# EAGLE board ABK-ECS - Rev A2 (EAGLE 7.7.0)
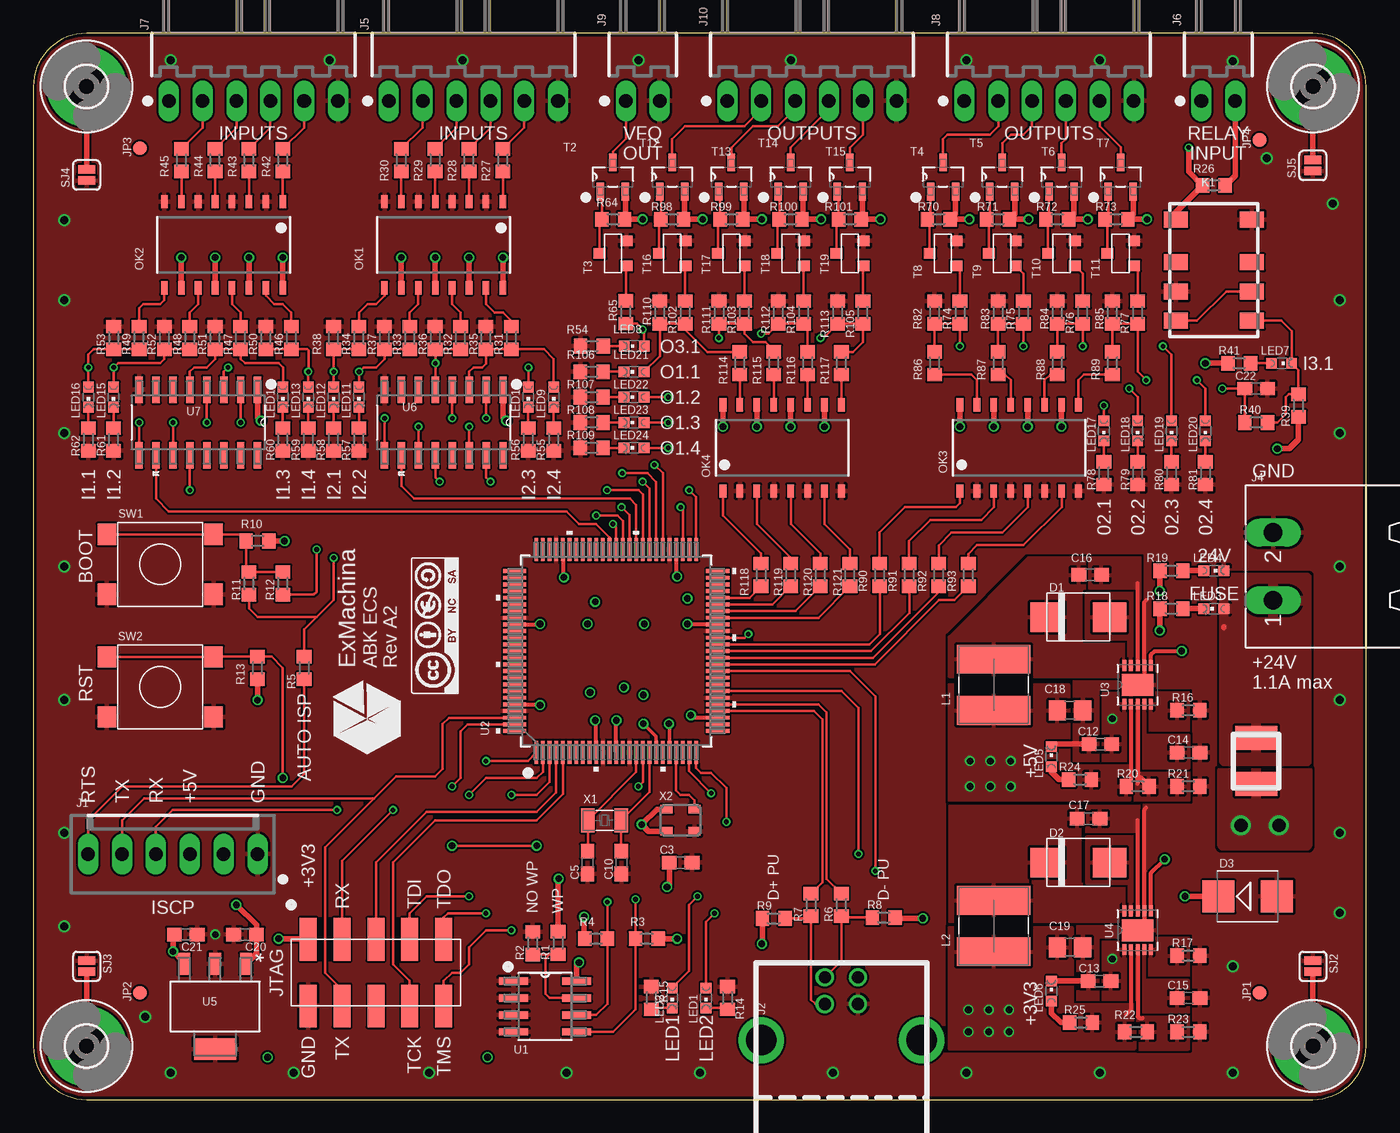
[diagram p5: board, top side]
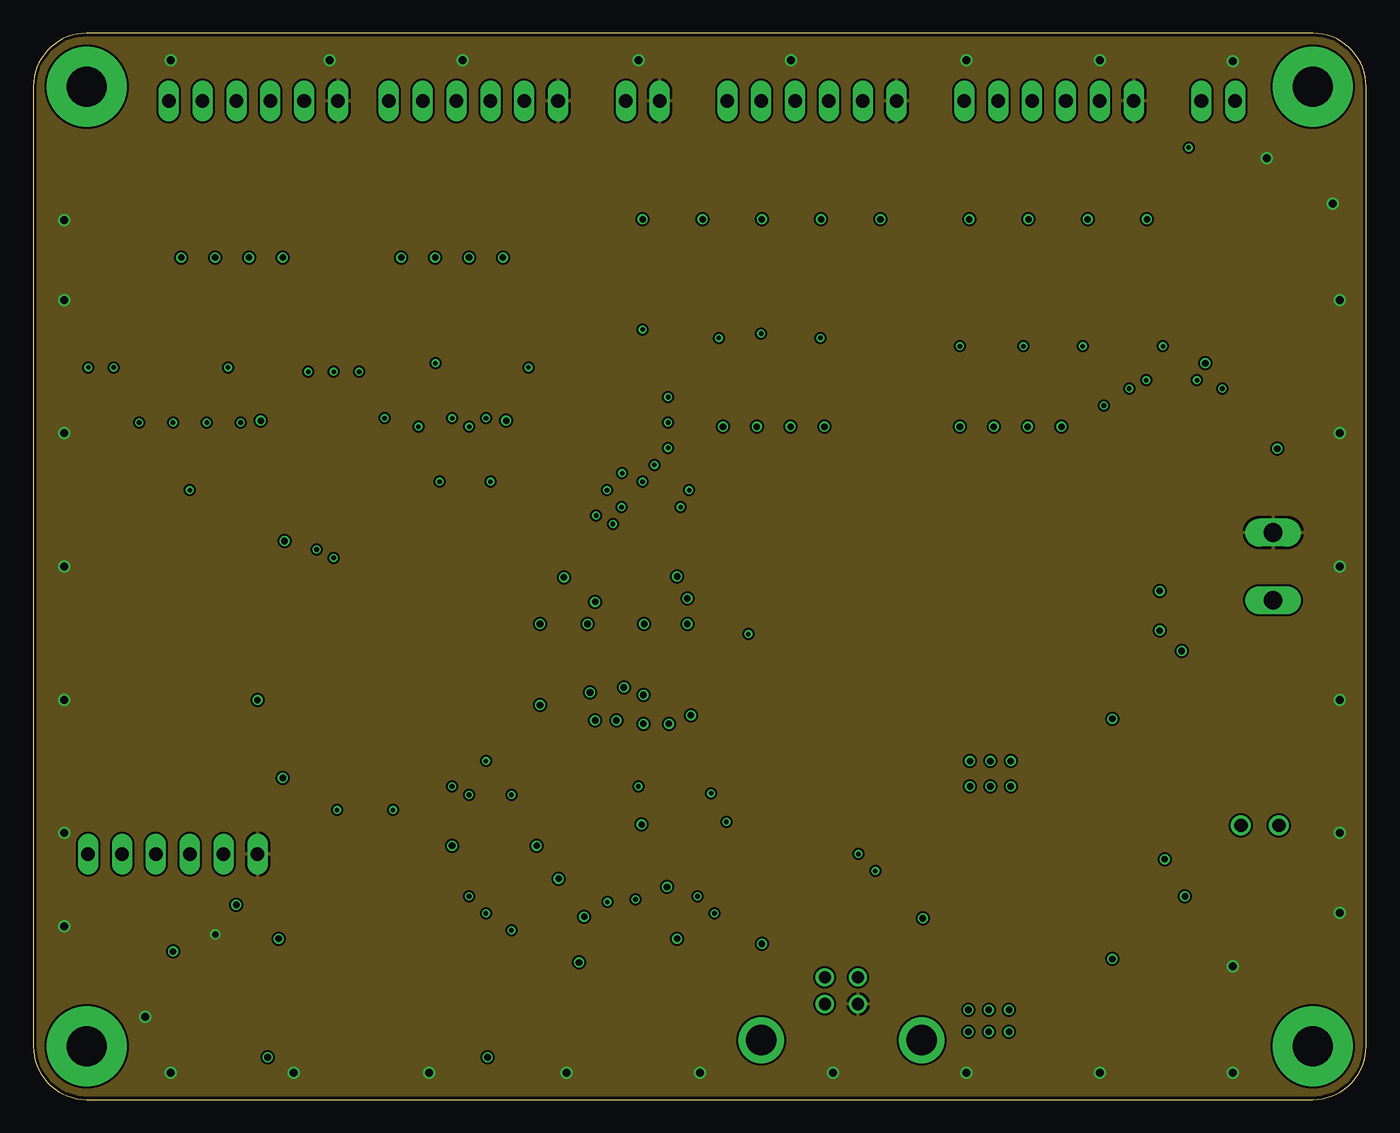
[diagram p6: board, inner layer Route2]
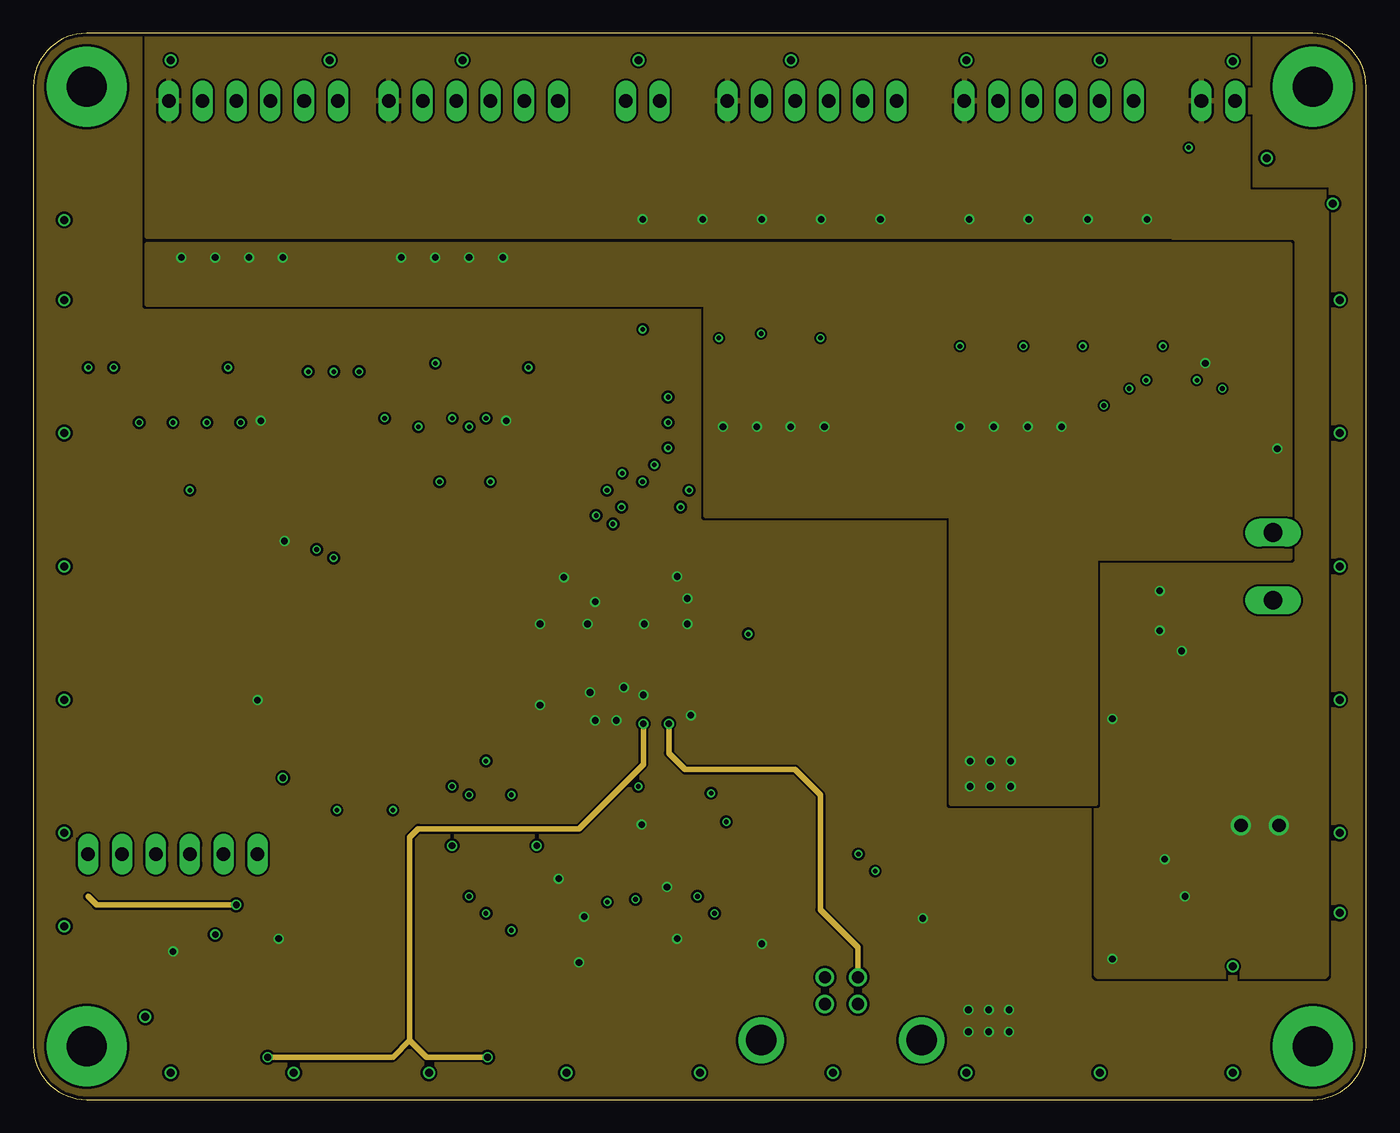
[diagram p7: board, inner layer Route15]
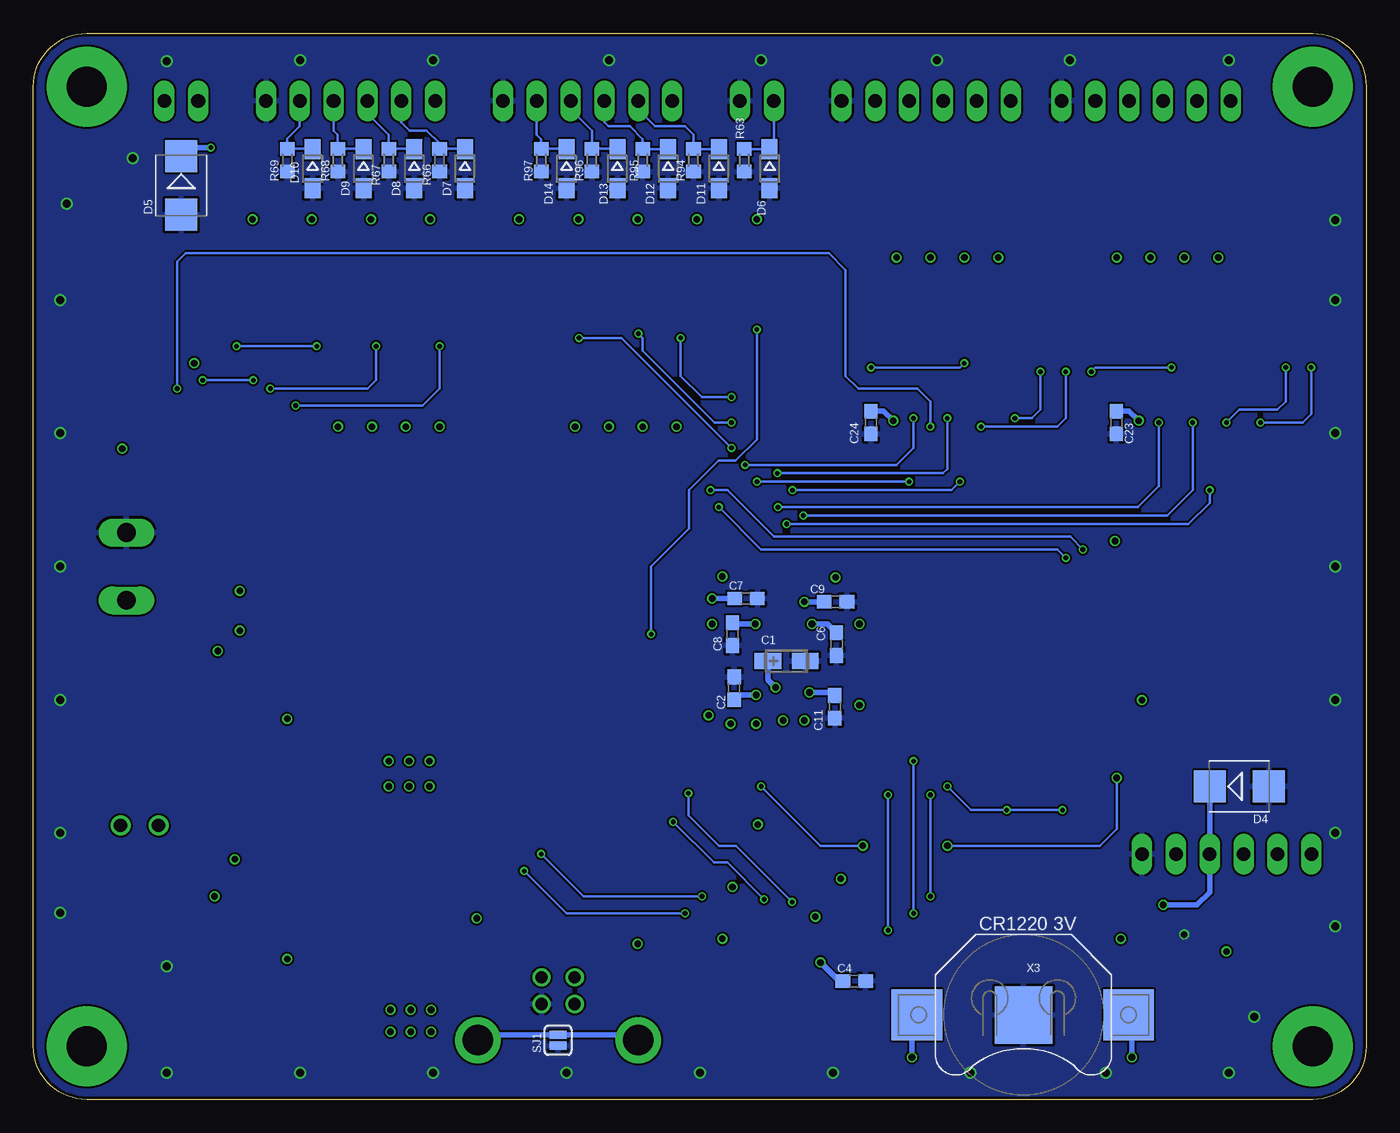
[diagram p8: board, bottom side, seen from below]

Size 100 x 80 mm. Coordinates in mm from the lower left corner, seen from the top.
Outline: 4,0 96,0 arc90 100,4 100,76 arc90 96,80 4,80 arc90 0,76 0,4 arc90 4,0
Copper layers (1+2*15+16): Top 0.018mm / dielectric 0.36mm / Route2 0.035mm / dielectric 0.71mm / Route15 0.035mm / dielectric 0.2mm / Bottom 0.018mm
Design rules "eC_4Layer_PClass6_BaseCopperO18-I35_eCDefault *": minimum track width 0.15mm, minimum drill 0.35mm, track to track 0.15mm, track to pad 0.15mm, pad to pad 0.15mm, via to via 0.15mm, smd to smd 0mil, copper to edge 0.25mm, drill to drill 0.35mm, minimum pad ring 0.175mm, minimum via ring 0.125mm, stop-mask expansion 0mil, vias tented up to drill 0.45mm, thermal gap 0.2mm
Net classes: 0 default: width 0.178 mm; 1 signal: width 0.178 mm, drill 0.35 mm; 2 supply: width 0.008 mm, drill 0.5 mm

## Footprints (pad centres in the part's own frame; a part is rotated, then mirrored left to right if it is on the bottom)
CT3216 = smd 2 x 1.2: + -1.4,0; - 1.4,0
C0603 = smd 1.1 x 1: 1 -0.85,0; 2 0.85,0
C0805 = smd 1.3 x 1.5: 1 -0.95,0; 2 0.95,0
DO-214AA = smd 2.5 x 2.2: A 2.35,0; C -2.35,0
SMB = smd 2.4 x 2.4: A 2.2,0; C -2.2,0
SOD323-W = smd 1.5 x 1.2: A 1.45,0; C -1.45,0
LITTLEFUSE_SMD = smd 1.78 x 3.15: 1 -1.725,0; 2 1.725,0
6410-06 = drill 1.016 long: 1 6.35,0; 2 3.81,0; 3 1.27,0; 4 -1.27,0; 5 -3.81,0; 6 -6.35,0
USB-B-S-RA = drill 0.914: 1 1.245,4.724; 2 -1.245,4.724; 3 -1.245,2.718; 4 1.245,2.718 | drill 2.286: SHL 6.02,0; SHL1 -6.02,0
2.54/2X5 = smd 1.27 x 3.2: 1 -5.08,2.5; 2 -5.08,-2.5; 3 -2.54,2.5; 4 -2.54,-2.5; 5 0,2.5; 6 0,-2.5; 7 2.54,2.5; 8 2.54,-2.5; 9 5.08,2.5; 10 5.08,-2.5
MSTBA2 = drill 1.397 long: 1 -2.54,5.08; 2 2.54,5.08
7395-06 = drill 1.016 long: 1 6.35,0; 2 3.81,0; 3 1.27,0; 4 -1.27,0; 5 -3.81,0; 6 -6.35,0
7395-02 = drill 1.016 long: 1 1.27,0; 2 -1.27,0
FIDUCIAL-1X2 = smd 1 x 1: 1 0,0
G6K-2G-Y = smd 1.2 x 1.8: 1 -3.8,-2.85; 2 -0.6,-2.85; 3 1.6,-2.85; 4 3.8,-2.85; 5 3.8,2.85; 6 1.6,2.85; 7 -0.6,2.85; 8 -3.8,2.85
WE-PD2_5848/5820 = smd 2.15 x 5.5: 1 -1.925,0; 2 1.925,0
CHIPLED_0603 = smd 0.8 x 0.8: A 0,-0.75; C 0,0.75
P3,0 = drill 3 pad 6: 1 0,0
MINI-FLAT-16 = smd 1 x 0.5: 1 -3.24,4.445; 2 -3.24,3.175; 3 -3.24,1.905; 4 -3.24,0.635; 5 -3.24,-0.635; 6 -3.24,-1.905; 7 -3.24,-3.175; 8 -3.24,-4.445; 9 3.24,-4.445; 10 3.24,-3.175; 11 3.24,-1.905; 12 3.24,-0.635; 13 3.24,0.635; 14 3.24,1.905; 15 3.24,3.175; 16 3.24,4.445
R0603 = smd 1 x 1.1: 1 -0.85,0; 2 0.85,0
SJ_2S = smd 0.635 x 1.27: 1 -0.412,0; 2 0.412,0
B3FS = smd 1.4 x 1.6: 1 4,-2.25; 2 -4,-2.25; 3 4,2.25; 4 -4,2.25
SOT95P240X112-3N = smd 1.321 x 0.559: 1 -1.092,0.94; 2 -1.092,-0.94; 3 1.092,0
SOT−23 = smd 0.787 x 0.889: 1 0.94,1.003; 2 -0.94,1.003; 3 0,-1.003
SOIC127P600X175-8N = smd 2.184 x 0.559: 1 -2.362,1.905; 2 -2.362,0.635; 3 -2.362,-0.635; 4 -2.362,-1.905; 5 2.362,-1.905; 6 2.362,-0.635; 7 2.362,0.635; 8 2.362,1.905
SOT407-1 = smd 1.727 x 0.279: 1 -7.62,6; 2 -7.62,5.5; 3 -7.62,5; 4 -7.62,4.5; 5 -7.62,4; 6 -7.62,3.5; 7 -7.62,3; 8 -7.62,2.5; 9 -7.62,2; 10 -7.62,1.5; 11 -7.62,1; 12 -7.62,0.5; 13 -7.62,0; 14 -7.62,-0.5; 15 -7.62,-1; 16 -7.62,-1.5; 17 -7.62,-2; 18 -7.62,-2.5; 19 -7.62,-3; 20 -7.62,-3.5; 21 -7.62,-4; 22 -7.62,-4.5; 23 -7.62,-5; 24 -7.62,-5.5; 25 -7.62,-6; 51 7.62,-6; 52 7.62,-5.5; 53 7.62,-5; 54 7.62,-4.5; 55 7.62,-4; 56 7.62,-3.5; 57 7.62,-3; 58 7.62,-2.5; 59 7.62,-2; 60 7.62,-1.5; 61 7.62,-1; 62 7.62,-0.5; 63 7.62,0; 64 7.62,0.5; 65 7.62,1; 66 7.62,1.5; 67 7.62,2; 68 7.62,2.5; 69 7.62,3; 70 7.62,3.5; 71 7.62,4; 72 7.62,4.5; 73 7.62,5; 74 7.62,5.5; 75 7.62,6 | smd 0.279 x 1.727: 26 -6,-7.62; 27 -5.5,-7.62; 28 -5,-7.62; 29 -4.5,-7.62; 30 -4,-7.62; 31 -3.5,-7.62; 32 -3,-7.62; 33 -2.5,-7.62; 34 -2,-7.62; 35 -1.5,-7.62; 36 -1,-7.62; 37 -0.5,-7.62; 38 0,-7.62; 39 0.5,-7.62; 40 1,-7.62; 41 1.5,-7.62; 42 2,-7.62; 43 2.5,-7.62; 44 3,-7.62; 45 3.5,-7.62; 46 4,-7.62; 47 4.5,-7.62; 48 5,-7.62; 49 5.5,-7.62; 50 6,-7.62; 76 6,7.62; 77 5.5,7.62; 78 5,7.62; 79 4.5,7.62; 80 4,7.62; 81 3.5,7.62; 82 3,7.62; 83 2.5,7.62; 84 2,7.62; 85 1.5,7.62; 86 1,7.62; 87 0.5,7.62; 88 0,7.62; 89 -0.5,7.62; 90 -1,7.62; 91 -1.5,7.62; 92 -2,7.62; 93 -2.5,7.62; 94 -3,7.62; 95 -3.5,7.62; 96 -4,7.62; 97 -4.5,7.62; 98 -5,7.62; 99 -5.5,7.62; 100 -6,7.62
DFN300X300X80-11N = smd 0.813 x 0.305: 1 -1.448,0.991; 2 -1.448,0.508; 3 -1.448,0; 4 -1.448,-0.508; 5 -1.448,-0.991; 6 1.448,-0.991; 7 1.448,-0.508; 8 1.448,0; 9 1.448,0.508; 10 1.448,0.991 | smd 1.651 x 2.388: 11 0,0
SOT230P700X180-4N = smd 1.626 x 0.889: 1 -3.2,2.311; 2 -3.2,0; 3 -3.2,-2.311 | smd 1.626 x 3.175: 4 3.2,0
SOIC127P600X175-16N = smd 1.981 x 0.559: 1 -2.464,4.445; 2 -2.464,3.175; 3 -2.464,1.905; 4 -2.464,0.635; 5 -2.464,-0.635; 6 -2.464,-1.905; 7 -2.464,-3.175; 8 -2.464,-4.445; 9 2.464,-4.445; 10 2.464,-3.175; 11 2.464,-1.905; 12 2.464,-0.635; 13 2.464,0.635; 14 2.464,1.905; 15 2.464,3.175; 16 2.464,4.445
FC-135 = smd 1 x 1.8: 1 -1.25,0; 2 1.25,0
ASE = smd 0.9 x 0.65: 1 -1.05,-0.825; 2 1.05,-0.825; 3 1.05,0.825; 4 -1.05,0.825
3000 = smd 3.81 x 3.81: +1 -7.874,0; +2 8.001,0 | smd 4.318 x 4.318: - 0,0

## Placement (x,y rotation side)
C1  10uF  [CT3216]  43.48,32.89 0 bottom
C2  0.1uF  [C0603]  47.42,30.86 90 bottom
C3  0.1uF  [C0603]  48.56,17.78 0 top
C4  0.1uF  [C0603]  38.41,8.89 0 bottom
C5  18pF  [C0603]  41.58,17.78 270 top
C6  0.1uF  [C0603]  39.74,34.16 270 bottom
C7  0.1uF  [C0603]  46.53,37.59 0 bottom
C8  0.1uF  [C0603]  47.55,34.92 270 bottom
C9  0.1uF  [C0603]  39.8,37.34 0 bottom
C10  18pF  [C0603]  44.12,17.78 270 top
C11  0.1uF  [C0603]  39.87,29.46 270 bottom
C12  2.2uF  [C0603]  80.06,26.67 180 top
C13  2.2uF  [C0603]  80,8.89 180 top
C14  1000pF  [C0603]  86.67,26.04 0 top
C15  1000pF  [C0603]  86.67,7.62 0 top
C16  2.2uF  [C0603]  79.3,39.37 180 top
C17  2.2uF  [C0603]  79.17,21.08 180 top
C18  22uF  [C0805]  77.78,29.21 0 top
C19  22uF  [C0805]  77.78,11.43 0 top
C20  1u  [C0603]  15.89,12.38 180 top
C21  1u  [C0603]  11.44,12.38 0 top
C22  0.1uF  [C0603]  91.75,53.34 0 top
C23  0.1uF  [C0603]  18.75,50.8 270 bottom
C24  0.1uF  [C0603]  37.16,50.8 270 bottom
CC1  CC-BY-NC-SA  [CC-BY-NC-SA]  30.15,35.56 90 top
D1  MBRS140  [DO-214AA]  78.41,36.2 0 top
D2  MBRS140  [DO-214AA]  78.41,17.78 0 top
D3  STPS3L40UF  [SMB]  91.11,15.24 0 top
D4  STPS3L40UF  [SMB]  9.53,23.5 0 bottom
D5  STPS3L40UF  [SMB]  88.9,68.59 270 bottom
D6  1N4148WS  [SOD323-W]  44.76,69.85 270 bottom
D7  1N4148WS  [SOD323-W]  67.61,69.85 270 bottom
D8  1N4148WS  [SOD323-W]  71.42,69.85 270 bottom
D9  1N4148WS  [SOD323-W]  75.23,69.85 270 bottom
D10  1N4148WS  [SOD323-W]  79.05,69.85 270 bottom
D11  1N4148WS  [SOD323-W]  48.56,69.85 270 bottom
D12  1N4148WS  [SOD323-W]  52.38,69.85 270 bottom
D13  1N4148WS  [SOD323-W]  56.19,69.85 270 bottom
D14  1N4148WS  [SOD323-W]  59.99,69.85 270 bottom
F1  1812L110/24DR  [LITTLEFUSE_SMD]  91.75,25.4 270 top
J1  22-27-2061-06  [6410-06]  10.46,18.41 0 top
J2  USB-B-S-RA  [USB-B-S-RA]  60.63,4.45 0 top
J3  1241050-5  [2.54/2X5]  25.7,9.53 0 top
J4  MSTBA2  [MSTBA2]  98.09,40 90 top
J5  22-05-7068-06  [7395-06]  33.02,74.93 180 top
J6  22-05-7028-02  [7395-02]  88.9,74.93 180 top
J7  22-05-7068-06  [7395-06]  16.51,74.93 180 top
J8  22-05-7068-06  [7395-06]  76.2,74.93 180 top
J9  22-05-7028-02  [7395-02]  45.72,74.93 180 top
J10  22-05-7068-06  [7395-06]  58.42,74.93 180 top
JP1  FIDUCIAL1X2  [FIDUCIAL-1X2]  92,8 90 top
JP2  FIDUCIAL1X2  [FIDUCIAL-1X2]  8,8 90 top
JP3  FIDUCIAL1X2  [FIDUCIAL-1X2]  8,71.36 90 top
JP4  FIDUCIAL1X2  [FIDUCIAL-1X2]  92,72 90 top
K1  G6K-2G-Y  [G6K-2G-Y]  88.57,62.23 270 top
L1  15uH  [WE-PD2_5848/5820]  72.06,31.11 270 top
L2  10uH  [WE-PD2_5848/5820]  72.06,13.02 270 top
LED1  Blue  [CHIPLED_0603]  50.47,7.62 180 top
LED2  Blue  [CHIPLED_0603]  47.93,7.62 180 top
LED3  Red  [CHIPLED_0603]  88.57,36.83 90 top
LED4  Blue  [CHIPLED_0603]  88.57,39.69 270 top
LED5  Blue  [CHIPLED_0603]  76.38,25.72 0 top
LED6  Blue  [CHIPLED_0603]  76.38,8.13 0 top
LED7  Red  [CHIPLED_0603]  93.65,55.24 270 top
LED8  Blue  [CHIPLED_0603]  45.09,56.53 90 top
LED9  Blue  [CHIPLED_0603]  39.04,52.7 180 top
LED10  Blue  [CHIPLED_0603]  37.13,52.7 180 top
LED11  Blue  [CHIPLED_0603]  24.43,52.7 180 top
LED12  Blue  [CHIPLED_0603]  22.53,52.7 180 top
LED13  Blue  [CHIPLED_0603]  20.62,52.7 180 top
LED14  Blue  [CHIPLED_0603]  18.72,52.7 180 top
LED15  Blue  [CHIPLED_0603]  6.02,52.7 180 top
LED16  Blue  [CHIPLED_0603]  4.13,52.7 180 top
LED17  Blue  [CHIPLED_0603]  80.31,50.16 180 top
LED18  Blue  [CHIPLED_0603]  82.86,50.16 180 top
LED19  Blue  [CHIPLED_0603]  85.39,50.16 180 top
LED20  Blue  [CHIPLED_0603]  87.94,50.16 180 top
LED21  Blue  [CHIPLED_0603]  45.07,54.61 90 top
LED22  Blue  [CHIPLED_0603]  45.07,52.7 90 top
LED23  Blue  [CHIPLED_0603]  45.07,50.8 90 top
LED24  Blue  [CHIPLED_0603]  45.07,48.9 90 top
MP1  MOUNT-PAD3,0  [P3,0]  96,4 90 top
MP2  MOUNT-PAD3,0  [P3,0]  4,4 90 top
MP3  MOUNT-PAD3,0  [P3,0]  4,76 90 top
MP4  MOUNT-PAD3,0  [P3,0]  96,76 90 top
OK1  TLP283-4  [MINI-FLAT-16]  30.79,64.14 270 top
OK2  TLP283-4  [MINI-FLAT-16]  14.28,64.14 270 top
OK3  TLP283-4  [MINI-FLAT-16]  73.97,48.9 90 top
OK4  TLP283-4  [MINI-FLAT-16]  56.19,48.9 90 top
R1  4K7, DNI  [R0603]  39.37,11.75 270 top
R2  4K7  [R0603]  37.47,11.73 90 top
R3  4K7  [R0603]  46.02,12.06 0 top
R4  4K7  [R0603]  42.22,12.06 180 top
R5  0R  [R0603]  20.32,32.38 270 top
R6  33  [R0603]  60.63,14.61 90 top
R7  33  [R0603]  58.34,14.61 90 top
R8  1K5, DNI  [R0603]  63.8,13.65 180 top
R9  1K5, DNI  [R0603]  55.55,13.59 0 top
R10  10K  [R0603]  16.82,41.91 0 top
R11  0R  [R0603]  16.18,38.73 90 top
R12  0R  [R0603]  18.72,38.73 90 top
R13  10K  [R0603]  16.82,32.38 270 top
R14  1K5  [R0603]  52.08,7.62 90 top
R15  1K5  [R0603]  46.37,7.62 90 top
R16  31K6  [R0603]  86.67,29.21 180 top
R17  31K6  [R0603]  86.67,10.79 180 top
R18  4K7  [R0603]  85.39,36.83 180 top
R19  4K7  [R0603]  85.39,39.69 180 top
R20  52K3  [R0603]  82.86,23.5 180 top
R21  10K  [R0603]  86.67,23.5 180 top
R22  31K6  [R0603]  82.73,5.08 180 top
R23  10K  [R0603]  86.67,5.08 180 top
R24  1K5  [R0603]  78.54,24 0 top
R25  1K5  [R0603]  78.6,5.78 0 top
R26  100  [R0603]  88.57,68.58 180 top
R27  1K  [R0603]  35.23,70.48 270 top
R28  1K  [R0603]  32.69,70.48 270 top
R29  1K  [R0603]  30.15,70.48 270 top
R30  1K  [R0603]  27.61,70.48 270 top
R31  1K  [R0603]  35.87,57.15 270 top
R32  1K  [R0603]  32.05,57.15 270 top
R33  1K  [R0603]  28.25,57.15 270 top
R34  1K  [R0603]  24.43,57.15 270 top
R35  4K7  [R0603]  33.96,57.15 90 top
R36  4K7  [R0603]  30.15,57.15 90 top
R37  4K7  [R0603]  26.34,57.15 90 top
R38  4K7  [R0603]  22.53,57.15 90 top
R39  4K7  [R0603]  94.92,52.07 90 top
R40  100  [R0603]  91.75,50.8 180 top
R41  1K5  [R0603]  90.47,55.24 180 top
R42  1K  [R0603]  18.72,70.48 270 top
R43  1K  [R0603]  16.18,70.48 270 top
R44  1K  [R0603]  13.64,70.48 270 top
R45  1K  [R0603]  11.11,70.48 270 top
R46  1K  [R0603]  19.36,57.15 270 top
R47  1K  [R0603]  15.54,57.15 270 top
R48  1K  [R0603]  11.73,57.15 270 top
R49  1K  [R0603]  7.94,57.15 270 top
R50  4K7  [R0603]  17.45,57.15 90 top
R51  4K7  [R0603]  13.64,57.15 90 top
R52  4K7  [R0603]  9.83,57.15 90 top
R53  4K7  [R0603]  6.03,57.15 90 top
R54  1K5  [R0603]  41.91,56.53 180 top
R55  1K5  [R0603]  39.04,49.53 270 top
R56  1K5  [R0603]  37.13,49.53 270 top
R57  1K5  [R0603]  24.43,49.53 270 top
R58  1K5  [R0603]  22.53,49.53 270 top
R59  1K5  [R0603]  20.62,49.53 270 top
R60  1K5  [R0603]  18.72,49.53 270 top
R61  1K5  [R0603]  6.02,49.53 270 top
R62  1K5  [R0603]  4.13,49.53 270 top
R63  10K  [R0603]  46.66,70.48 90 bottom
R64  10K  [R0603]  43.51,66.04 0 top
R65  100  [R0603]  44.45,59.07 270 top
R66  10K  [R0603]  69.52,70.48 90 bottom
R67  10K  [R0603]  73.33,70.48 90 bottom
R68  10K  [R0603]  77.14,70.48 90 bottom
R69  10K  [R0603]  80.95,70.48 90 bottom
R70  10K  [R0603]  67.93,66.04 0 top
R71  10K  [R0603]  72.38,66.04 0 top
R72  10K  [R0603]  76.82,66.04 0 top
R73  10K  [R0603]  81.27,66.04 0 top
R74  1K  [R0603]  69.52,59.05 90 top
R75  1K  [R0603]  74.28,59.05 90 top
R76  1K  [R0603]  78.73,59.05 90 top
R77  1K  [R0603]  82.86,59.05 90 top
R78  1K5  [R0603]  80.31,46.99 270 top
R79  1K5  [R0603]  82.86,46.99 270 top
R80  1K5  [R0603]  85.39,46.99 270 top
R81  1K5  [R0603]  87.94,46.99 270 top
R82  4K7  [R0603]  67.61,59.05 90 top
R83  4K7  [R0603]  72.38,59.05 90 top
R84  4K7  [R0603]  76.82,59.05 90 top
R85  4K7  [R0603]  80.95,59.05 90 top
R86  100  [R0603]  67.61,55.24 270 top
R87  100  [R0603]  72.38,55.24 270 top
R88  100  [R0603]  76.82,55.24 270 top
R89  100  [R0603]  80.95,55.24 270 top
R90  330  [R0603]  63.49,39.37 270 top
R91  330  [R0603]  65.71,39.37 270 top
R92  330  [R0603]  67.93,39.37 270 top
R93  330  [R0603]  70.16,39.37 270 top
R94  10K  [R0603]  50.47,70.48 90 bottom
R95  10K  [R0603]  54.28,70.48 90 bottom
R96  10K  [R0603]  58.09,70.48 90 bottom
R97  10K  [R0603]  61.9,70.48 90 bottom
R98  10K  [R0603]  47.93,66.04 0 top
R99  10K  [R0603]  52.38,66.04 0 top
R100  10K  [R0603]  56.82,66.04 0 top
R101  10K  [R0603]  61.27,66.04 0 top
R102  1K  [R0603]  48.91,59.05 90 top
R103  1K  [R0603]  53.35,59.05 90 top
R104  1K  [R0603]  57.8,59.05 90 top
R105  1K  [R0603]  62.24,59.05 90 top
R106  1K5  [R0603]  41.9,54.61 180 top
R107  1K5  [R0603]  41.9,52.7 180 top
R108  1K5  [R0603]  41.9,50.8 180 top
R109  1K5  [R0603]  41.9,48.9 180 top
R110  4K7  [R0603]  47,59.05 90 top
R111  4K7  [R0603]  51.45,59.05 90 top
R112  4K7  [R0603]  55.89,59.05 90 top
R113  4K7  [R0603]  60.34,59.05 90 top
R114  100  [R0603]  53.01,55.24 270 top
R115  100  [R0603]  55.55,55.24 270 top
R116  100  [R0603]  58.09,55.24 270 top
R117  100  [R0603]  60.63,55.24 270 top
R118  330  [R0603]  54.6,39.37 270 top
R119  330  [R0603]  56.82,39.37 270 top
R120  330  [R0603]  59.04,39.37 270 top
R121  330  [R0603]  61.27,39.37 270 top
SJ1  SOLDERJUMPERNC  [SJ_2S]  60.63,4.45 90 bottom
SJ2  SOLDERJUMPERNC  [SJ_2S]  96,10 270 top
SJ3  SOLDERJUMPERNC  [SJ_2S]  4,10 270 top
SJ4  SOLDERJUMPERNC  [SJ_2S]  4,69.36 90 top
SJ5  SOLDERJUMPERNC  [SJ_2S]  96,70.08 90 top
SW1  B3FS-1015  [B3FS]  9.52,40.16 0 top
SW2  B3FS-1015  [B3FS]  9.52,30.95 0 top
T1  EXMACHINA-LOGO-NAME  [EXM-LOGO-BASELINE]  25.07,28.57 90 top
T2  IRLML5103TRPBF  [SOT95P240X112-3N]  43.48,69.22 90 top
T3  MMBT2222AL  [SOT−23]  43.5,63.49 270 top
T4  IRLML5103TRPBF  [SOT95P240X112-3N]  68.25,69.22 90 top
T5  IRLML5103TRPBF  [SOT95P240X112-3N]  72.69,69.22 90 top
T6  IRLML5103TRPBF  [SOT95P240X112-3N]  77.14,69.22 90 top
T7  IRLML5103TRPBF  [SOT95P240X112-3N]  81.58,69.22 90 top
T8  MMBT2222AL  [SOT−23]  68.25,63.5 270 top
T9  MMBT2222AL  [SOT−23]  72.69,63.5 270 top
T10  MMBT2222AL  [SOT−23]  77.14,63.5 270 top
T11  MMBT2222AL  [SOT−23]  81.58,63.5 270 top
T12  IRLML5103TRPBF  [SOT95P240X112-3N]  47.93,69.22 90 top
T13  IRLML5103TRPBF  [SOT95P240X112-3N]  52.38,69.22 90 top
T14  IRLML5103TRPBF  [SOT95P240X112-3N]  56.82,69.22 90 top
T15  IRLML5103TRPBF  [SOT95P240X112-3N]  61.27,69.22 90 top
T16  MMBT2222AL  [SOT−23]  47.93,63.5 270 top
T17  MMBT2222AL  [SOT−23]  52.38,63.5 270 top
T18  MMBT2222AL  [SOT−23]  56.82,63.5 270 top
T19  MMBT2222AL  [SOT−23]  61.27,63.5 270 top
U1  AT24C512C-SSHM-B  [SOIC127P600X175-8N]  38.41,6.99 0 top
U2  LPC1768FBD100  [SOT407-1]  43.73,33.65 90 top
U3  LT3686HDDPBF  [DFN300X300X80-11N]  82.86,31.11 90 top
U4  LT3686HDDPBF  [DFN300X300X80-11N]  82.86,12.7 90 top
U5  TC1264-3.3  [SOT230P700X180-4N]  13.64,6.99 270 top
U6  CD4050BD  [SOIC127P600X175-16N]  30.8,50.8 270 top
U7  CD4050BD  [SOIC127P600X175-16N]  12.38,50.8 270 top
X1  FC-135  [FC-135]  42.85,20.95 0 top
X2  ASE-12  [ASE]  48.56,20.95 0 top
X3  3000  [3000]  25.7,6.35 180 bottom

## Tracks (layer width: path | path; a pad name or v marks a point on that pad's centre or on a via)
1
  Top 0.406: MP1.1 SJ2.2
2
  Top 0.406: MP2.1 SJ3.2
3
  Top 0.406: SJ4.2 MP3.1
4
  Top 0.406: MP4.1 SJ5.2
!JTAG_TRST
  Top 0.178: J3.5 25.7,17.78 29.52,21.59 37.77,21.59 39.23,23.05 U2.4
!RESET  (via drill 0.35, 0.5)
  Top 0.178: SW2.4 SW2.3 13.55,33.23 R13.1 17.87,33.23 18.72,32.38 v18.72,24.13 | U2.17 45.73,23.84 v45.39,23.5 | v37.77,19.05 v31.42,19.05
  Bottom 0.178: v45.39,23.5 40.95,19.05 v37.77,19.05 | v31.42,19.05 19.99,19.05 18.72,20.32 v18.72,24.13
+3V3  (via drill 0.5)
  Top 0.305: U4.2 82.35,6.73 82,6.39 | U2.42 49.11,35.65 v49.07,35.69 | U2.54 48.23,39.32 v48.31,39.24 | U2.13 v43.73,28.44 v43.74,28.45 | U2.96 37.97,29.65 v38.02,29.59 | U2.84 37.99,35.65 v38.02,35.69 | U2.71 39.73,39.25 v39.8,39.18 | U2.28 49.51,28.65 v49.33,28.83 | U2.10 42.23,28.45 v42.15,28.45
  Top 0.406: U1.8 40.77,10.11 v40.95,10.29 | C3.1 47.72,16.11 v47.55,15.94 | R10.2 v18.85,41.91 | R13.2 v16.82,29.97 | J3.1 20.59,12.06 v18.4,12.06 | R3.2 v48.31,12.06 | R4.2 41.33,12.1 v41.33,13.72 | R9.1 54.7,11.72 v54.66,11.68 | X2.1 46.15,20.13 v45.64,20.64 46.79,21.78 X2.4 | R8.1 arc90 64.72,13.59 v66.73,13.59 | 11.3,10.16 U5.3 11.33,10.26 v10.48,11.11 10.48,12.27 C21.1 | U7.1 16.83,51.17 v17.07,50.93 | U6.1 35.24,51.17 v35.48,50.93 | v39.42,16.57 39.37,16.52 R1.1
  Bottom 0.254: C2.1 47.38,29.97
  Bottom 0.406: C7.1 v49.07,37.59 | v41.58,35.69 40.41,35.69 C6.1 | C9.1 v42.15,37.34 | C8.1 47.46,35.69 v45.83,35.69 | C1.+ 44.88,31.5 v44.31,30.92 | 47.38,29.97 47,30.35 v45.77,30.35 | C11.1 40.09,30.54 v41.77,30.54 | C23.1 17.79,51.65 v17.07,50.93 | v35.48,50.93 36.21,51.65 C24.1 | C4.1 39.55,8.89 v40.95,10.29
  other vias: 70.16,5.08 71.68,5.08 73.2,5.08 71.68,6.73 70.16,6.73 73.2,6.73
  pour Route15 (isolate 0.178, rank 6): 108.89,-12.06 108.89,94.61 -9.86,94.61 -9.86,-12.06
  pour Top: 82.6,3.81 68.76,3.81 68.76,12.89 77.9,12.89 77.9,7.11 82.6,7.11
+5V  (via drill 0.5)
  Top 0.305: U3.2 82.35,23.84 R20.2
  Top 0.406: R41.2 v87.94,55.24 | OK1.10 v27.61,63.18 | OK1.12 v30.15,63.18 | OK1.14 v32.69,63.18 | OK1.16 v35.23,63.18 | R39.1 94.92,49.53 94.22,48.83 v93.33,48.83 | OK3.10 v77.14,50.48 | OK3.12 v74.6,50.48 | OK3.14 v72.06,50.48 | OK3.16 v69.52,50.48 | OK2.12 v13.64,63.18 | OK2.14 v16.18,63.18 | OK2.16 v18.72,63.18 | OK4.10 v59.36,50.48 | OK4.12 v56.82,50.48 | OK4.14 v54.28,50.48 | OK4.16 v51.74,50.48 | OK2.10 v11.1,63.18
  other vias: 70.28,23.5 71.81,23.5 73.33,23.5 73.33,25.4 71.81,25.4 70.28,25.4
  pour Top: 68.76,22.48 68.76,31.11 77.65,31.11 77.65,25.02 82.22,25.02 82.22,22.48
  pour Route15 (rank 2): 68.89,22.23 68.89,43.81 50.47,43.81 50.47,59.69 8.56,59.69 8.56,64.14 94.28,64.14 94.28,40.64 79.68,40.64 79.68,22.23
+5V/1  (via drill 0.5)
  Top 0.406: v15.23,14.61 16.74,13.1 C20.1 16.74,10.97 U5.1
  Route15 0.406: 4.12,15.24 4.75,14.61 v15.23,14.61
  Bottom 0.406: v15.23,14.61 12.7,14.61 11.75,15.56 11.75,18.4 J1.3 11.72,18.43 D4.C
+24V  (via drill 0.5, 1)
  Top 0.305: U4.6 83.85,16.99 v84.89,18.03 | U3.6 83.85,33.38 84.12,33.66 v86.16,33.66
  Top 0.406: D3.C v86.41,15.24 | R18.2 84.51,36.79 v84.51,35.18 | R19.2 84.51,39.65 v84.51,38.16 | 69.19,68.34 T4.2 69.19,66.45 R70.2 v70.22,66.04 | 73.64,68.34 T5.2 73.64,66.45 R71.2 v74.66,66.04 | 78.08,68.34 T6.2 78.08,66.45 R72.2 v79.11,66.04 | 82.53,68.34 T7.2 82.53,66.45 R73.2 v83.55,66.04 | F1.2 91.87,23.55 | v59.11,66.04 R100.2 57.76,66.13 T14.2 | v54.66,66.04 R99.2 53.31,66.13 T13.2 | v50.22,66.04 R98.2 48.87,66.13 T12.2 | v63.55,66.04 R101.2 62.2,66.13 T15.2 | v45.72,66.04 R64.2 44.42,66.11 T2.2
  other vias: 80.95,10.54 80.95,28.57 90.6,20.57 93.46,20.57
  pour Route15: 91.11,82.55 91.11,64.77 8.56,64.77 8.56,81.92
  pour Top (rank 2): 80.31,7.37 80.31,11.81 82.09,11.81 82.09,7.37
  pour Route15 (rank 3): 96.83,67.94 96.83,9.4 79.93,9.4 79.93,40.51 85.78,40.51 85.78,67.94
  pour Top (rank 3): 80.31,25.4 80.31,30.48 82.09,30.48 82.09,25.4
  pour Top (rank 2): 89.22,19.05 89.22,24.77 95.57,24.77 95.57,19.05
BOOT_SELECT_P2_10  (via drill 0.35)
  Top 0.178: R11.1 16.18,36.83 16.82,36.2 21.26,36.2 | 21.26,36.2 22.53,37.47 v22.53,40.64 | v48.56,44.45 48.73,44.28 U2.53 | R5.1 20.32,35.26 21.26,36.2
  Bottom 0.178: v22.53,40.64 23.16,41.27 45.39,41.27 v48.56,44.45
BOOT_SELECT_P2_12  (via drill 0.35)
  Top 0.178: R12.1 21.05,37.88 21.26,38.1 v21.26,41.27 | U2.51 49.73,45.19 v49.2,45.72
  Bottom 0.178: v21.26,41.27 22.21,42.23 44.44,42.23 47.93,45.72 v49.2,45.72
EEPROM_SCL  (via drill 0.35)
  Top 0.178: U1.6 42.22,6.35 43.06,7.2 R4.1 v43.06,14.82 | U2.24 49.2,26 49.2,24.64 v50.85,22.99
  Bottom 0.178: v43.06,14.82 47.3,19.05 48.56,19.05 50.85,21.34 v50.85,22.99
EEPROM_SDA  (via drill 0.35)
  Top 0.178: U1.5 43.48,5.08 45.17,6.77 R3.1 | U2.25 49.73,24.87 50.09,24.51 50.85,24.51 51.99,23.37 v51.99,20.83 | 45.17,12.74 R3.1 | v45.17,15.03 R3.1
  Bottom 0.178: v45.17,15.03 47.93,17.78 48.95,17.78 v51.99,20.83
GND  (via drill 0.5, 0.6)
  Top 0.305: U4.11 83.36,13.21 U4.7 83.36,21.78 83.49,21.91 | U3.11 83.36,31.62 U3.7 83.36,37.34 83.49,37.47
  Top 0.406: C12.2 76.58,26.67 LED5.C | U4.11 82.86,12.38 | C13.2 LED6.C
  other vias: 90,2 90,10 2.31,13 98,14 98,20 98,30 98,40 98,50 98,60 97.49,67.22 92.54,70.64 90,77.91 80,78 70,78 45.4,78 32.22,78 22.22,78 10.31,78 2.31,60 2.31,66 2.31,50 2.31,40 2.31,30 2.31,20 8.41,6.19 10.31,2 40,2 50,2 60,2 70,2 80,2 19.52,2 56.83,78 13.65,12.38 29.68,2
  pour Top (rank 6): 106.35,-9.53 106.35,92.08 -7.32,92.08 -7.32,-9.53
  pour Bottom: 110.16,-13.34 110.16,95.89 -11.12,95.89 -11.12,-13.34
  pour Route2: 107.62,-10.79 107.62,93.34 -8.59,93.34 -8.59,-10.79
  pour Top (rank 6): 80.19,7.11 78.09,7.11 78.09,13.97 84.12,13.97 84.12,12.06 80.19,12.06
INPUT1.1  (via drill 0.35)
  Top 0.178: LED16.A v4.13,54.93 4.13,55.88 4.55,56.3 R53.1 R49.2 | U7.9 v7.94,50.8
  Bottom 0.178: v4.13,54.93 4.13,51.44 4.76,50.8 v7.94,50.8
INPUT1.1_MCU
  Top 0.178: U2.64 43.23,42.18 42.23,43.18 40.96,43.18 40.01,44.13 10.16,44.13 9.21,45.09 U7.10
INPUT1.2  (via drill 0.35)
  Top 0.178: R48.2 R52.1 9.83,55.55 9.53,55.24 6.35,55.24 v6.03,54.93 6.03,53.47 LED15.A | U7.11 v10.48,50.8
  Bottom 0.178: v10.48,50.8 9.53,51.75 6.67,51.75 6.03,52.39 v6.03,54.93
INPUT1.2_MCU  (via drill 0.35)
  Top 0.178: U2.63 43.73,42.94 v43.48,43.18 | v11.75,45.72 U7.12
  Bottom 0.178: v43.48,43.18 13.34,43.18 11.75,44.77 v11.75,45.72
INPUT1.3
  Top 0.178: LED14.A 18.73,53.47 18.73,54.93 18.41,55.24 15.88,55.24 15.54,55.58 R47.2 R51.1 13.64,55.55 13.02,54.93 12.06,54.93 11.75,54.61 U7.5
INPUT1.3_MCU  (via drill 0.35)
  Top 0.178: U7.4 v13.02,50.8 | U2.62 44.23,43.4 43.81,43.81 v42.23,43.81
  Bottom 0.178: v42.23,43.81 14.92,43.81 13.02,45.72 v13.02,50.8
INPUT1.4  (via drill 0.35)
  Top 0.178: R50.1 R46.2 20.54,56.3 20.64,56.2 20.64,54.62 v20.62,54.61 LED13.A | U7.3 14.29,54.61 v14.61,54.93
  Bottom 0.178: v20.62,54.61 20.31,54.93 v14.61,54.93
INPUT1.4_MCU  (via drill 0.35)
  Top 0.178: U2.61 44.73,43.85 v44.13,44.45 | v15.56,50.8 U7.2
  Bottom 0.178: v44.13,44.45 17.14,44.45 15.56,46.04 v15.56,50.8
INPUT2.1  (via drill 0.35)
  Top 0.178: R34.2 R38.1 22.53,54.62 v22.54,54.61 22.53,54.6 LED12.A | U6.11 v28.89,50.48
  Bottom 0.178: v28.89,50.48 23.18,50.48 22.54,51.12 v22.54,54.61
INPUT2.1_MCU  (via drill 0.35)
  Top 0.178: U2.59 45.73,45.38 45.39,45.72 v43.04,45.72 | U6.12 30.16,46.67 v30.48,46.35
  Bottom 0.178: v43.04,45.72 31.11,45.72 v30.48,46.35
INPUT2.2  (via drill 0.35)
  Top 0.178: LED11.A 24.43,54.6 v24.45,54.61 24.77,54.93 25.72,54.93 26.34,55.55 R37.1 R33.2 | U6.9 v26.35,51.12
  Bottom 0.178: v26.35,51.12 25.08,51.12 24.45,51.75 v24.45,54.61
INPUT2.2_MCU
  Top 0.178: U2.60 45.23,44.61 44.76,45.09 28.57,45.09 27.62,46.04 U6.10
INPUT2.3  (via drill 0.35)
  Top 0.178: R32.2 R36.1 30.16,56.29 v30.16,55.24 U6.5 | v37.15,54.93 37.15,53.47 LED10.A
  Bottom 0.178: v37.15,54.93 30.48,54.93 v30.16,55.24
INPUT2.3_MCU  (via drill 0.35)
  Top 0.178: U2.57 46.73,46.35 46.09,46.99 v44.18,46.99 | v31.43,51.12 U6.4
  Bottom 0.178: v44.18,46.99 31.75,46.99 31.43,47.31 v31.43,51.12
INPUT2.4
  Top 0.178: R35.1 R31.2 38.31,56.3 39.04,55.58 LED9.A | R35.1 33.96,55.89 | U6.3 32.7,54.61 33.02,54.93 33.66,54.93 33.96,55.23 R35.1
INPUT2.4_MCU  (via drill 0.35)
  Top 0.178: U2.56 47.23,46.99 v46.6,47.62 | v33.97,51.12 U6.2
  Bottom 0.178: v46.6,47.62 35.23,47.62 33.97,48.88 v33.97,51.12
INPUT3.1  (via drill 0.35)
  Top 0.178: R40.2 C22.1 v89.2,53.34 | U6.14 v32.7,50.48
  Bottom 0.178: v89.2,53.34 89.2,62.87 88.57,63.5 40.32,63.5 39.05,62.23 39.05,54.29 38.1,53.34 33.66,53.34 32.7,52.39 v32.7,50.48
INPUT3.1_MCU  (via drill 0.35)
  Top 0.178: U2.58 46.23,45.83 v45.71,46.35 | U6.15 33.97,46.67 v34.29,46.35
  Bottom 0.178: v34.29,46.35 v45.71,46.35
ISP_RTS
  Top 0.178: R5.2 20.32,24.45 19.37,23.5 6.67,23.5 4.12,20.94 J1.6
ISP_RXDO  (via drill 0.35)
  Top 0.178: J1.4 9.2,20.45 10.46,21.72 v22.78,21.72 | U2.99 32.58,28.15 32.05,27.62 32.05,24.13 v31.42,23.5 | J3.3 23.16,17.91 v26.98,21.72
  Bottom 0.178: v31.42,23.5 29.64,21.72 v26.98,21.72 v22.78,21.72
ISP_TXDO
  Top 0.178: 25.58,22.61 27.23,24.26 30.15,24.26 30.71,24.82 30.71,28.18 31.18,28.65 U2.98 | J3.4 22.91,7.28 22.91,8.51 21.89,9.53 21.89,18.92 25.58,22.61 | J1.5 6.66,20.95 8.31,22.61 25.58,22.61
JTAG_TCK
  Top 0.178: U2.5 39.73,22.91 37.77,20.95 30.15,20.95 26.98,17.78 26.98,10.16 28.25,8.89 J3.8
JTAG_TDI  (via drill 0.35)
  Top 0.178: U2.2 38.23,24.59 37.77,24.13 33.96,24.13 v32.69,22.86 | v32.69,15.24 29.52,15.24 28.25,13.97 J3.7
  Bottom 0.178: v32.69,22.86 v32.69,15.24
JTAG_TDO  (via drill 0.35)
  Top 0.178: U2.1 37.1,25.4 v33.96,25.4 | v33.96,13.97 31.11,13.97 30.8,13.65 30.8,12.04 J3.9
  Bottom 0.178: v33.96,25.4 v33.96,13.97
JTAG_TMS  (via drill 0.35)
  Top 0.178: U2.3 38.73,23.82 37.77,22.86 v35.87,22.86 | v35.87,12.7 33.96,12.7 32.69,11.43 32.69,10.16 32.05,9.53 31.42,9.53 30.79,8.89 J3.10
  Bottom 0.178: v35.87,22.86 v35.87,12.7
MOTOR_VFQ
  Top 0.178: T2.3 43.48,71.12 44.45,72.08 J9.1
  Bottom 0.178: J9.1 44.45,71.61 D6.C 46.62,71.3 R63.2
N$1
  Top 0.178: J2.3 58.67,7.16 58.34,7.49 R7.1 58.18,13.59 R9.2
N$2
  Top 0.178: J2.2 60.63,10.41 R6.1 arc90 60.73,13.65 R8.2
N$3
  Top 0.178: LED2.C 46.47,6.87 R15.1
N$4
  pour Top (rank 4): 86.67,27.3 86.67,30.48 83.49,30.48 83.49,27.3
N$5
  Top 0.178: R12.2 R11.2 15.96,39.8 R10.1 15.47,42.41 SW1.3 SW1.4
N$6
  pour Top (rank 2): 86.67,27.3 86.67,24.89 83.24,24.89 83.24,30.23 83.36,30.23 83.36,27.3
N$7
  pour Top (rank 4): 86.67,8.89 86.67,12.06 83.36,12.06 83.36,9.02
N$8
  pour Top (rank 2): 86.67,6.6 86.67,8.89 83.36,8.89 83.36,12.06 83.11,12.06 83.11,6.6
N$9
  Top 0.305: U3.3 82.86,24.13 82.86,23.71
  Top 0.406: R20.1 83.07,24.13 82.86,24.13
  pour Top (rank 3): 86.67,24.77 86.67,22.48 81.58,22.48 81.58,24.77 82.6,24.77 82.6,30.23 82.98,30.23 82.98,24.77
N$10
  Top 0.305: U3.8 82.86,38.73
  pour Top (rank 2): 82.73,32 82.73,38.35 79.3,38.35 79.3,40.64 82.98,40.64 82.98,32
N$11
  pour Top (rank 5): 68.76,31.75 68.76,34.69 74.71,40.64 79.05,40.64 79.05,34.29 82.09,34.29 82.09,31.75
N$12
  pour Top: 82.22,32 82.22,34.54 79.05,34.54 79.05,37.97 82.73,37.97 82.73,32
N$13
  Top 0.305: U4.3 82.86,6.22 82.98,6.1 83.24,6.1 | 83.49,5.08 R22.1
  pour Top (rank 3): 86.67,3.81 86.67,6.48 82.86,6.48 82.86,11.81 82.6,11.81 82.47,6.48 82.47,3.81
N$14
  Top 0.305: U4.8 82.86,20.95
  pour Top (rank 2): 79.05,19.94 82.73,19.94 82.73,13.72 83.11,13.72 83.11,21.97 79.05,21.97
N$15
  pour Top (rank 5): 82.09,13.4 82.09,16 78.54,16.13 78.54,21.97 68.76,21.97 68.76,13.4
N$16
  pour Top: 79.05,16.26 82.22,16.26 82.22,13.59 82.6,13.59 82.6,19.68 79.05,19.68
N$17
  Top 0.178: R74.2 69.52,62.29 T8.1
N$18
  Top 0.178: T8.3 67.25,65.88 R70.1 67.31,66.27 T4.1
N$19
  Top 0.178: R75.2 74.28,61.98 T9.1
N$20
  Top 0.178: T9.3 71.69,65.88 R71.1 71.75,66.27 T5.1
N$21
  Top 0.178: R76.2 78.73,61.98 T10.1
N$22
  Top 0.178: T6.1 76.2,66.27 R72.1 76.14,65.88 T10.3
N$23
  Top 0.178: R77.2 82.86,62.29 T11.1
N$24
  Top 0.178: T11.3 80.58,65.88 R73.1 80.64,66.27 T7.1
N$25
  Top 0.178: R65.1 44.45,62.5 T3.1
N$26
  Top 0.178: T2.1 42.66,68.01 R64.1 42.49,65.87 T3.3
N$27
  Top 0.178: R2.1 38.73,10.88 | 38.73,10.88 39.37,10.88 R1.2 | U1.7 38.73,7.62 38.42,7.94 38.42,10.57 38.73,10.88
N$28  (via drill 0.35)
  Top 0.406: K1.1 85.72,66.58 R26.2 86.68,69.62 v86.68,71.44
  Bottom 0.406: D5.C 88.25,71.44 v86.68,71.44
N$29
  Top 0.178: LED1.C 51.98,6.87 R14.1
N$31
  Top 0.178: R114.1 50.59,56.09 48.91,57.77 R102.1 R110.1 47,55.79 LED21.A
N$32
  Top 0.406: R26.1 90.17,69.33 J6.2
N$33
  Top 0.178: R114.2 OK4.15
N$34  (via drill 0.35)
  Top 0.178: R115.1 55.46,56.09 55.46,56.3 54.93,56.83 53.98,56.83 53.35,57.45 R103.1 R111.1 51.44,58.19 v51.44,57.15 | LED22.A v47.62,52.7
  Bottom 0.178: v47.62,52.7 49.85,52.7 51.44,54.29 v51.44,57.15
N$35
  Top 0.178: OK4.13 R115.2
N$36  (via drill 0.35)
  Top 0.178: R116.1 58.09,57.91 R104.1 R112.1 55.16,57.47 v54.61,57.47 | LED23.A v47.62,50.8
  Bottom 0.178: v47.62,50.8 48.9,50.8 54.29,56.2 54.29,57.15 v54.61,57.47
N$37  (via drill 0.35)
  Top 0.178: R117.1 61.49,56.09 62.23,56.83 R105.1 R113.1 59.28,57.15 v59.05,57.15 | LED24.A v47.62,48.9
  Bottom 0.178: v59.05,57.15 55.88,57.15 v47.62,48.9
N$38
  Top 0.178: R116.2 OK4.11
N$39
  Top 0.178: R117.2 OK4.9
N$40
  Top 0.178: R118.1 54.6,40.97 51.74,43.83 OK4.1
N$41
  Top 0.178: OK1.1 R27.2
N$42
  Top 0.178: R119.1 56.82,40.65 54.29,43.18 54.29,45.64 OK4.3
N$43
  Top 0.178: R121.1 61.27,41.29 59.37,43.18 59.37,45.64 OK4.7
N$44
  Top 0.406: R19.1 LED4.A
N$45
  Top 0.406: LED3.C R18.1
N$46
  Top 0.178: R120.1 59.04,40.97 56.83,43.18 56.83,45.64 OK4.5
N$47
  Top 0.178: OK1.3 R28.2
N$48
  Top 0.178: OK1.5 R29.2
N$49
  Top 0.178: OK1.7 R30.2
N$50
  Top 0.406: 76.48,7.28 LED6.A 76.38,6.48 77.08,5.78 R25.1
N$51
  Top 0.406: R24.1 76.95,24 76.38,24.57 LED5.A
N$52
  Top 0.178: R30.1 29.21,72.94 J5.2
N$53
  Top 0.178: R29.1 31.75,72.94 J5.3
N$54
  Top 0.178: R28.1 34.29,72.94 J5.4
N$55
  Top 0.178: R27.1 36.83,72.94 J5.5
N$56
  Top 0.178: R54.1 LED8.C
N$57
  Top 0.178: LED9.C R55.1
N$58
  Top 0.178: LED10.C R56.1
N$59
  Top 0.178: LED11.C R57.1
N$60
  Top 0.178: K1.4 87.31,58.43 89.51,60.63 K1.6
N$61
  Top 0.178: R34.1 24.43,59.05 25.07,59.69 25.7,59.69 26.34,60.33 OK1.9
N$62
  Top 0.178: OK1.11 28.88,59.69 28.25,59.05 R33.1
N$63
  Top 0.178: OK1.13 31.42,59.69 32.05,59.05 R32.1
N$64
  Top 0.178: OK1.15 33.96,59.69 34.59,59.05 35.23,59.05 35.87,58.42 R31.1
N$65
  Top 0.178: LED12.C R58.1
N$66
  Top 0.178: R106.1 LED21.C
N$67
  Top 0.178: LED22.C R107.1
N$68
  Top 0.178: LED23.C R108.1
N$69
  Top 0.178: R109.1 LED24.C
N$70
  Bottom 0.406: J2.SHL 66.24,4.86 SJ1.2 55.02,4.86 J2.SHL1
N$71
  Top 0.178: T16.3 46.93,65.89 R98.1 47.08,68.03 T12.1
N$72
  Top 0.178: T17.3 51.37,65.89 R99.1 51.52,68.03 T13.1
N$73
  Top 0.178: 95.34,52.92 R39.2 | R39.2 94.92,54.73 LED7.C 94.4,57.67 93.64,58.43 K1.5 | R40.1 93.33,50.8 93.97,51.44 93.97,52.7 94.18,52.92 R39.2
N$74
  Top 0.178: LED7.A R41.1
N$75  (via drill 0.35)
  Top 0.178: R86.1 R82.1 R74.1 v69.52,56.52 | LED17.A v80.31,52.07
  Bottom 0.178: v80.31,52.07 70.79,52.07 69.52,53.34 v69.52,56.52
N$76
  Top 0.178: R86.2 70.37,54.4 70.79,53.98 OK3.15
N$77
  Top 0.178: T18.3 55.82,65.89 R100.1 55.97,68.03 T14.1
N$78
  Top 0.178: T19.3 60.26,65.89 R101.1 60.41,68.03 T15.1
N$79  (via drill 0.35)
  Top 0.178: R87.1 R83.1 R75.1 v74.28,56.52 | LED18.A 82.86,52.7 v82.22,53.34
  Bottom 0.178: v74.28,56.52 74.28,53.98 74.92,53.34 v82.22,53.34
N$80
  Top 0.178: R87.2 72.91,54.4 73.33,53.98 OK3.13
N$81
  Top 0.178: R42.2 OK2.1
N$82
  Top 0.178: R42.1 20.32,72.94 J7.5
N$83  (via drill 0.35)
  Top 0.178: R88.1 R84.1 R76.1 v78.73,56.52 | LED19.A 85.39,55.88 v84.76,56.52
  Bottom 0.178: v84.76,56.52 v78.73,56.52
N$84
  Top 0.178: R102.2 48.91,62.53 T16.1
N$85
  Top 0.178: R103.2 53.35,62.53 T17.1
N$86  (via drill 0.35)
  Top 0.178: R89.1 R85.1 R77.1 82.86,54.61 v83.49,53.98 | LED20.A 87.94,53.34 v87.3,53.98
  Bottom 0.178: v87.3,53.98 v83.49,53.98
N$87
  Top 0.178: R88.2 76.29,54.4 75.87,53.98 OK3.11
N$88
  Top 0.178: R89.2 78.83,54.4 78.41,53.98 OK3.9
N$89
  Top 0.178: R90.1 63.49,42.53 65.41,44.45 69.22,44.45 69.53,44.77 69.53,45.64 OK3.1
N$90
  Top 0.178: LED16.C R62.1
N$91
  Top 0.178: R91.1 65.71,41.9 67.31,43.5 71.12,43.5 72.07,44.45 72.07,45.64 OK3.3
N$92
  Top 0.178: R93.1 70.16,40.95 70.8,41.59 74.3,41.59 77.15,44.45 77.15,45.64 OK3.7
N$93
  Top 0.178: R92.1 67.93,41.58 68.9,42.55 72.71,42.55 74.61,44.45 74.61,45.64 OK3.5
N$94
  Top 0.178: R78.1 LED17.C
N$95
  Top 0.178: R79.1 LED18.C
N$96
  Top 0.178: R80.1 LED19.C
N$97
  Top 0.178: R81.1 LED20.C
N$98
  Top 0.178: R104.2 57.8,62.53 T18.1
N$99
  Top 0.178: R105.2 62.24,62.53 T19.1
N$100
  Top 0.178: OK2.15 17.45,60.33 18.09,59.69 18.72,59.69 19.36,59.05 R46.1
N$101
  Top 0.178: OK2.3 R43.2
N$102
  Top 0.178: R43.1 17.78,72.94 J7.4
N$103
  Top 0.178: OK2.13 14.91,59.69 15.54,59.05 R47.1
N$104
  Top 0.178: R44.2 OK2.5
N$105
  Top 0.178: R44.1 15.24,72.94 J7.3
N$106
  Top 0.178: OK2.11 12.37,59.69 11.73,59.05 R48.1
N$107
  Top 0.178: R59.1 LED13.C
N$108
  Top 0.178: R60.1 LED14.C
N$109
  Top 0.178: R61.1 LED15.C
N$110
  Top 0.178: R49.1 7.94,59.37 8.26,59.69 9.53,59.69 9.83,59.99 OK2.9
N$111
  Top 0.178: OK2.7 11.11,67.39 R45.2
N$112
  Top 0.178: R45.1 12.7,72.92 J7.2
ONBOARD_LED1  (via drill 0.35)
  Top 0.178: U2.32 60.63,30.65 61.9,29.38 v61.9,18.41 | v49.84,15.24 49.2,14.61 49.2,9.64 LED2.A
  Bottom 0.178: v61.9,18.41 58.73,15.24 v49.84,15.24
ONBOARD_LED2  (via drill 0.35)
  Top 0.178: U2.35 61.27,32.15 63.17,30.25 v63.17,17.14 | LED1.A 50.47,13.34 v51.1,13.97
  Bottom 0.178: v51.1,13.97 59.99,13.97 v63.17,17.14
OUTPUT1.1
  Top 0.178: T12.3 47.93,72.06 48.9,73.03 53.34,73.03 54.61,74.3 J10.2
  Bottom 0.178: J10.2 54.61,74.3 53.34,73.03 51.12,73.03 50.47,72.38 R94.2 50.44,71.3 D11.C 48.56,71.42
OUTPUT1.1_MCU
  Top 0.178: U2.46 53.73,37.65 R118.2
OUTPUT1.2
  Top 0.178: T13.3 52.38,71.42 53.98,73.03 55.88,73.03 57.15,74.3 J10.3
  Bottom 0.178: D12.C 54.24,71.3 R95.2 54.28,72.06 55.24,73.03 56.83,73.03 57.15,73.34 J10.3 | D12.C 53.93,71.3 54.11,71.12 | D12.C 53.52,71.3
OUTPUT1.2_MCU
  Top 0.178: U2.45 55.45,37.15 R119.2
OUTPUT1.3
  Top 0.178: T14.3 56.82,71.42 59.69,74.3 J10.4
  Bottom 0.178: R96.2 56.22,71.33 D13.C | R96.2 58.2,71.33 | J10.4 59.69,74.3 58.09,72.69 R96.2
OUTPUT1.3_MCU
  Top 0.178: U2.44 57.17,36.65 R120.2
OUTPUT1.4
  Top 0.178: J10.5 62.23,72.39 61.27,71.42 T15.3
  Bottom 0.178: D14.C 60.03,71.33 R97.2 61.9,72.06 62.23,72.39 J10.5
OUTPUT1.4_MCU
  Top 0.178: U2.43 58.9,36.15 R121.2
OUTPUT2.1
  Top 0.178: T4.3 68.25,72.06 68.58,72.39 71.75,72.39 72.39,73.03 J8.2
  Bottom 0.178: D7.C 67.65,71.33 R66.2 69.52,71.74 70.48,72.71 71.75,72.71 72.39,73.34 J8.2
OUTPUT2.1_MCU
  Top 0.178: U2.39 62.73,34.15 63.5,34.92 63.5,38.51 R90.2
OUTPUT2.2
  Top 0.178: T5.3 72.69,71.74 73.34,72.39 74.3,72.39 74.93,73.03 J8.3
  Bottom 0.178: D8.C 71.46,71.33 R67.2 73.34,71.35 73.34,72.39 74.93,73.98 J8.3
OUTPUT2.2_MCU
  Top 0.178: U2.38 62.86,33.65 65.72,36.51 65.72,38.51 R91.2
OUTPUT2.3
  Top 0.178: T6.3 77.14,71.74 77.47,72.07 J8.4
  Bottom 0.178: D9.C 75.27,71.33 R68.2 77.15,71.35 77.15,72.39 77.47,72.71 J8.4
OUTPUT2.3_MCU
  Top 0.178: U2.37 62.99,33.15 67.93,38.09 R92.2
OUTPUT2.4
  Top 0.178: T7.3 81.58,71.45 80.01,73.03 J8.5
  Bottom 0.178: D10.C 79.08,71.33 R69.2 80.95,72.08 80.01,73.03 J8.5
OUTPUT2.4_MCU
  Top 0.178: U2.36 63.13,32.65 67.94,37.47 69.1,37.47 R93.2
OUTPUT3.2_MCU  (via drill 0.35)
  Top 0.178: U2.40 53.37,34.65 v53.65,34.92 | R65.2 45.29,58.22 v45.72,57.78 45.84,57.67 LED8.A
  Bottom 0.178: v53.65,34.92 53.65,40.01 50.8,42.85 50.8,45.72 48.58,47.94 47.31,47.94 45.72,49.53 v45.72,57.78
RTCX1
  Top 0.178: C5.1 41.6,18.65 X1.1 45.23,24.59 U2.16
RTCX2
  Top 0.178: C10.1 44.1,18.65 X1.2 46.23,23.09 U2.18
USB_D_N
  Top 0.178: U2.30 58.92,29.65 59.52,29.05 59.52,16.56 R6.2
USB_D_P
  Top 0.178: U2.29 58.55,29.15 59.2,28.51 59.2,16.31 R7.2
USB_V_BUS  (via drill 0.5)
  Top 0.254: U2.21 47.73,28.14 v47.68,28.19
  Route15 0.406: v47.68,28.19 47.68,25.98 48.9,24.77 57.15,24.77 59.05,22.86 59.05,14.25 61.88,11.43 J2.1
VBAT+  (via drill 0.5)
  Top 0.254: v45.77,28.19 46.73,27.23 U2.19
  Route15 0.406: 28.25,4.45 28.25,19.68 28.88,20.32 40.95,20.32 45.77,25.15 v45.77,28.19 | v34.09,3.17 29.52,3.17 28.25,4.45 | v17.58,3.17 26.98,3.17 28.25,4.45
  Bottom 0.406: X3.+2 34.09,5.97 v34.09,3.17 | X3.+1 17.58,6.1 v17.58,3.17
VIN
  Top 0.406: 89.33,35.43 89.32,35.45 | F1.1 91.87,27.25
  pour Top: 89.33,25.4 95.56,25.4 95.56,39.13 89.33,39.13
XTAL1
  Top 0.178: X2.3 49.62,22.45 49.2,22.86 48.56,22.86 48.23,23.2 U2.22

## Text on the board
tPlace: INPUTS | INPUTS | VFQ / OUT | OUTPUTS | OUTPUTS | RELAY / INPUT | O3.1 | O1.1 | I3.1 | O1.2 | O1.3 | O1.4 | I1.1 | I1.2 | I1.3 | I1.4 | I2.1 | I2.2 | I2.3 | I2.4 | GND | 02.1 | 02.2 | 02.3 | 02.4 | 24V | BOOT | FUSE | +24V / 1.1A max | ABK ECS / Rev A2 | RST | AUTO ISP | +5V | RTS | TX | RX | +5V | GND | +3V3 | ISCP | D+ PU | D- PU | RX | TDI | TDO | NO WP | WP | JTAG | +3V3 | LED1 | LED2 | GND | TX | TCK | TMS
bPlace: CR1220 3V